# EAGLE design JogWheel (EAGLE 7.5.0)
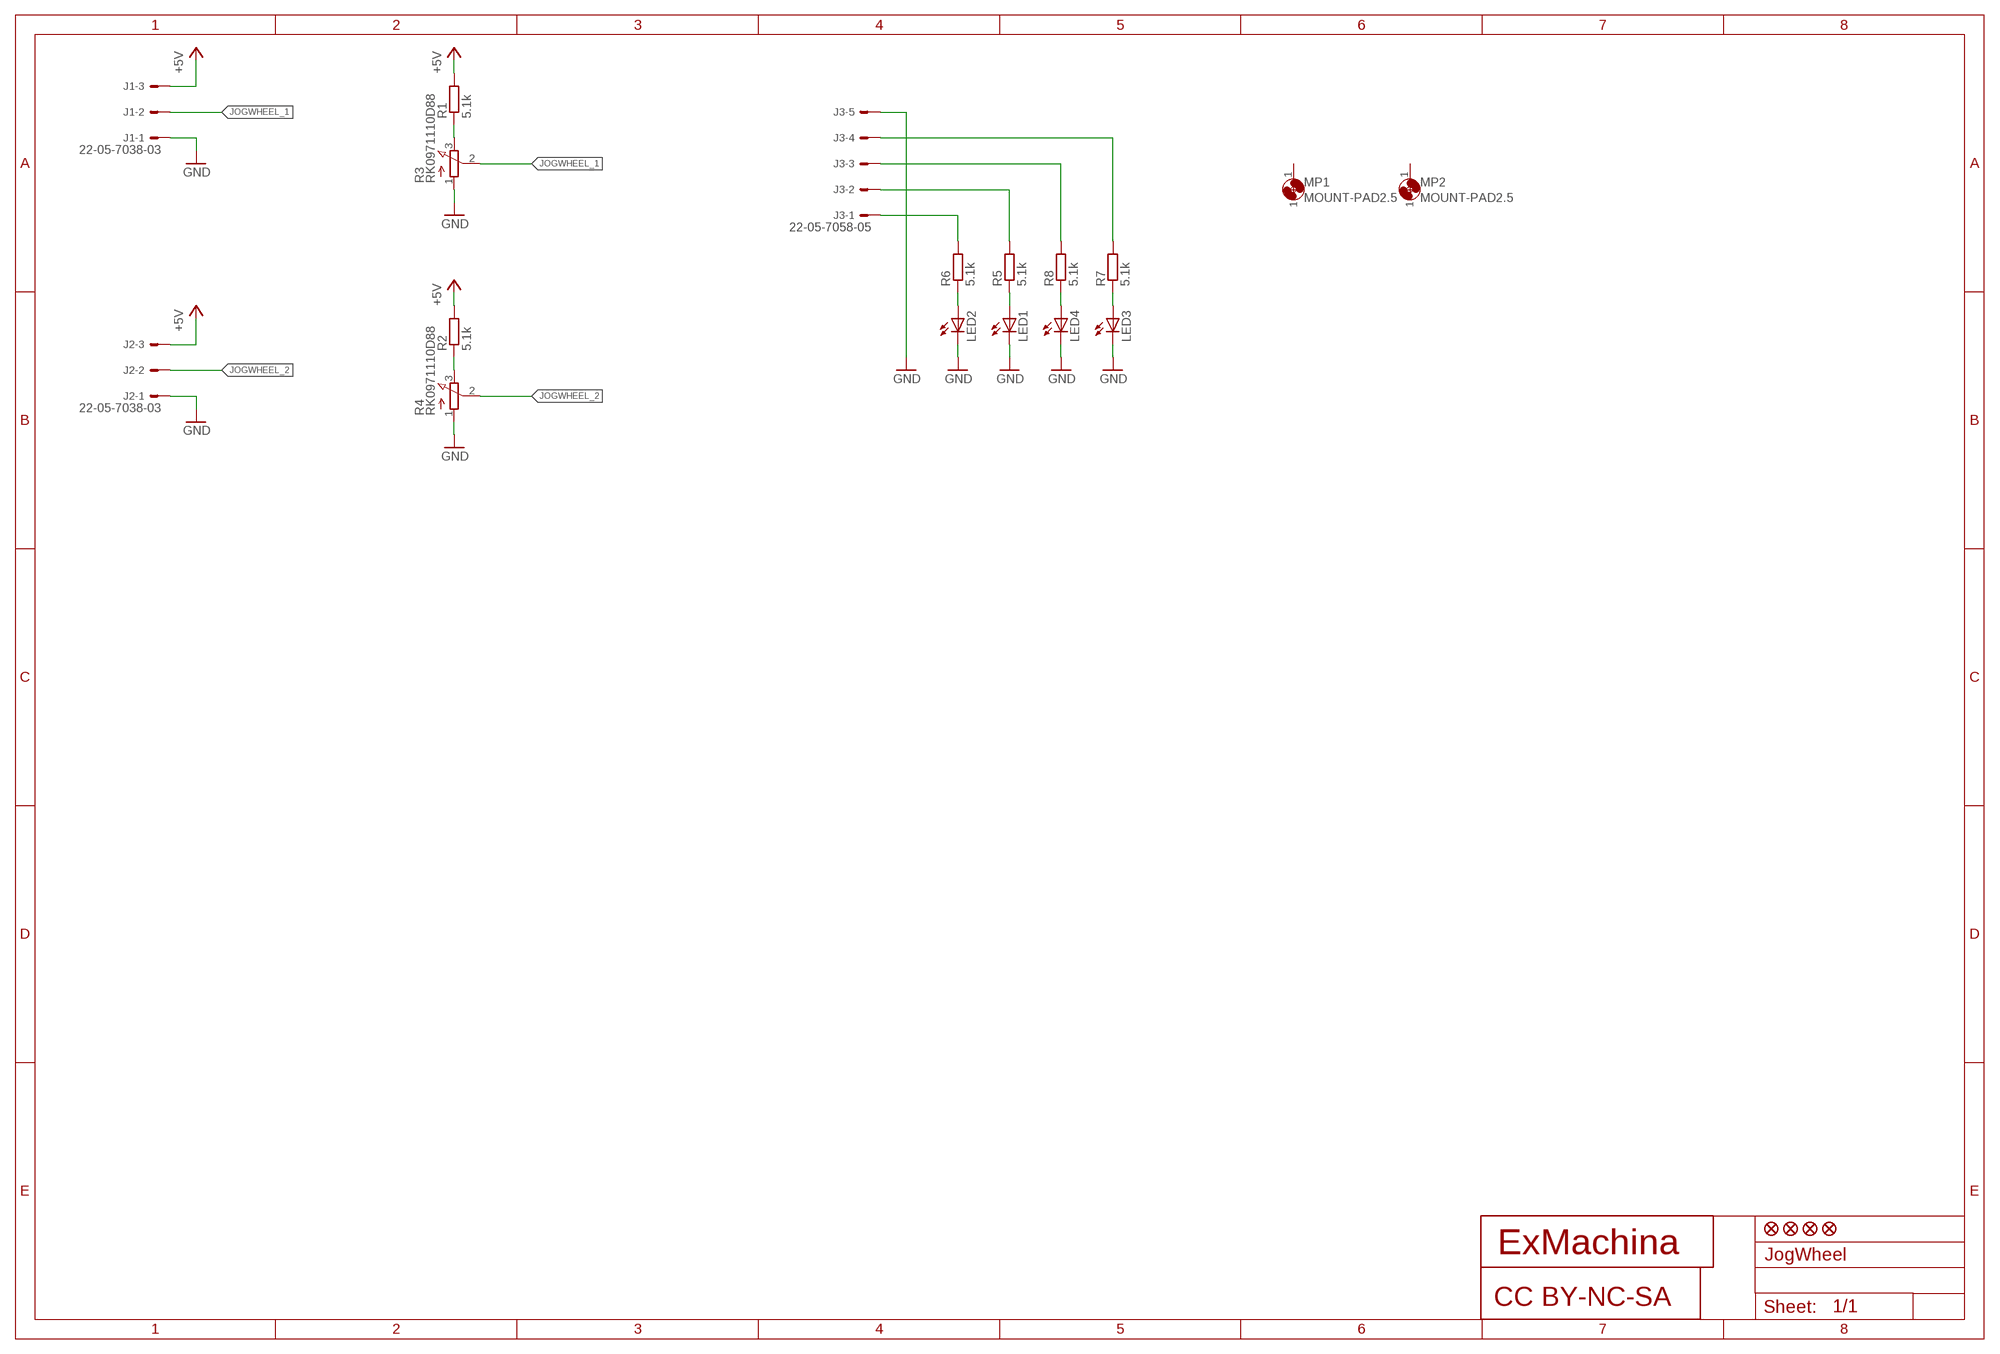
[diagram p0: schematic, sheet 1]

## Parts
J1  22-05-7038-03  [7395-03]
J2  22-05-7038-03  [7395-03]
J3  22-05-7058-05  [7395-05]
JP1  FIDUCIAL1X2  [FIDUCIAL-1X2]
JP2  FIDUCIAL1X2  [FIDUCIAL-1X2]
JP3  FIDUCIAL1X2  [FIDUCIAL-1X2]
JP4  FIDUCIAL1X2  [FIDUCIAL-1X2]
LED1  LEDCHIP-LED0603  [CHIP-LED0603]
LED2  LEDCHIP-LED0603  [CHIP-LED0603]
LED3  LEDCHIP-LED0603  [CHIP-LED0603]
LED4  LEDCHIP-LED0603  [CHIP-LED0603]
MP1  MOUNT-PAD2.5  [P2.5]
MP2  MOUNT-PAD2.5  [P2.5]
R1  5.1k  R-EU_R0603  [R0603]
R2  5.1k  R-EU_R0603  [R0603]
R3  RK0971110D88  [RK097]
R4  RK0971110D88  [RK097]
R5  5.1k  R-EU_R0603  [R0603]
R6  5.1k  R-EU_R0603  [R0603]
R7  5.1k  R-EU_R0603  [R0603]
R8  5.1k  R-EU_R0603  [R0603]
U$1  EXMACHINA-LOGO-NAME  [EXM-LOGO-BASELINE]
U$2  CC-BY-NC-SA  [CC-BY-NC-SA]

## Nets
+5V: J1.3 J2.3 R1.2 R2.2
GND: J1.1 J2.1 J3.5 LED1.C LED2.C LED3.C LED4.C R3.1(A) R4.1(A)
JOGWHEEL_1: J1.2 R3.2(S)
JOGWHEEL_2: J2.2 R4.2(S)
N$1: R1.1 R3.3(E)
N$2: R2.1 R4.3(E)
N$3: LED1.A R5.1
N$4: LED2.A R6.1
N$5: LED3.A R7.1
N$6: LED4.A R8.1
N$7: J3.4 R7.2
N$8: J3.1 R6.2
N$9: J3.2 R5.2
N$10: J3.3 R8.2
Unconnected: MP1.1 MP2.1

## Library data of the parts
J1 J2 = con-molex:22-?-03: CONNECTOR wire to board 2.54 mm (.1 inch) pitch header; OC_FARNELL: 9731610; OC_NEWARK: unknown
J3 = con-molex:22-?-05: CONNECTOR wire to board 2.54 mm (.1 inch) pitch header; OC_FARNELL: unknown; OC_NEWARK: unknown
JP1-JP4 = SparkFun:FIDUCIAL: Fiducial Alignment Points Various fiducial points for machine vision alignment.
LED1-LED4 = led:LED: LED OSRAM: - CHIPLED LG R971, LG N971, LY N971, LG Q971, LY Q971, LO R971, LY R971 LH N974, LH R974 LS Q976, LO Q976, LY Q976 LO Q996 - Hyper CHIPLED LW Q18S LB Q993, LB Q99A, LB R99A - SideLED LS A670, LO A670, LY A670, LG A670, LP A670 LB A673, LV A673, LT A673, LW A673 LH A674 LY A675 LS A676, LA A676, LO A676, LY A676, LW A676 LS A679, LY A679, LG A679 - Hyper Micro SIDELED® LS Y876, LA Y876, LO Y876, LY Y876 LT Y87S - SmartLED LW L88C, LW L88S LB L89C, LB L89S, LG L890 LS L89K, LO L89K, LY L89K LS L896, LA L896, LO L896, LY L896 - TOPLED LS T670, LO T670, LY T670, LG T670, LP T670 LSG T670, LSP T670, LSY T670, LOP T670, LYG T670 LG T671, LOG T671, LSG T671 LB T673, LV T673, LT T673, LW T673 LH T674 LS T676, LA T676, LO T676, LY T676, LB T676, LH T676, LSB T676, LW T676 LB T67C, LV T67C, LT T67C, LS T67K, LO T67K, LY T67K, LW E67C LS E67B, LA E67B, LO E67B, LY E67B, LB E67C, LV E67C, LT E67C LW T67C LS T679, LY T679, LG T679 LS T770, LO T770, LY T770, LG T770, LP T770 LB T773, LV T773, LT T773, LW T773 LH T774 LS E675, LA E675, LY E675, LS T675 LS T776, LA T776, LO T776, LY T776, LB T776 LHGB T686 LT T68C, LB T68C - Hyper Mini TOPLED® LB M676 - Mini TOPLED Santana® LG M470 LS M47K, LO M47K, LY M47K Source: http://www.osram.convergy.de LUXEON: - LUMILED® LXK2-PW12-R00, LXK2-PW12-S00, LXK2-PW14-U00, LXK2-PW14-V00 LXK2-PM12-R00, LXK2-PM12-S00, LXK2-PM14-U00 LXK2-PE12-Q00, LXK2-PE12-R00, LXK2-PE12-S00, LXK2-PE14-T00, LXK2-PE14-U00 LXK2-PB12-K00, LXK2-PB12-L00, LXK2-PB12-M00, LXK2-PB14-N00, LXK2-PB14-P00, LXK2-PB14-Q00 LXK2-PR12-L00, LXK2-PR12-M00, LXK2-PR14-Q00, LXK2-PR14-R00 LXK2-PD12-Q00, LXK2-PD12-R00, LXK2-PD12-S00 LXK2-PH12-R00, LXK2-PH12-S00 LXK2-PL12-P00, LXK2-PL12-Q00, LXK2-PL12-R00 Source: www.luxeon.com KINGBRIGHT: KA-3528ASYC Source: www.kingbright.com
MP1 MP2 = holes:MOUNT-PAD: MOUNTING HOLE with drill center marker
R1 R2 R5-R8 = rcl:R-EU_: RESISTOR, European symbol
R3 R4 = pot:RK097?
U$1 = exmachina:EXMACHINA-LOGO
U$2 = cc-by-sa:CC-BY-NC-SA

## Board
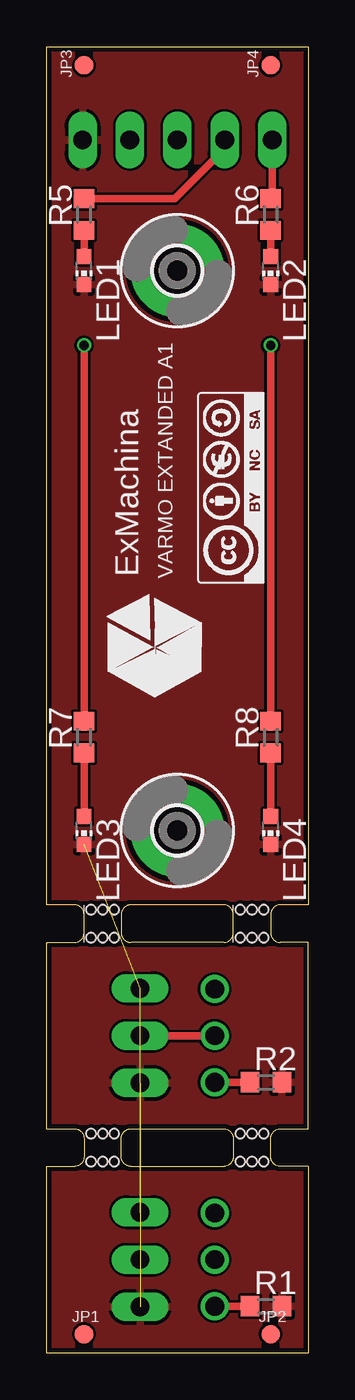
[diagram p1: board, top side]
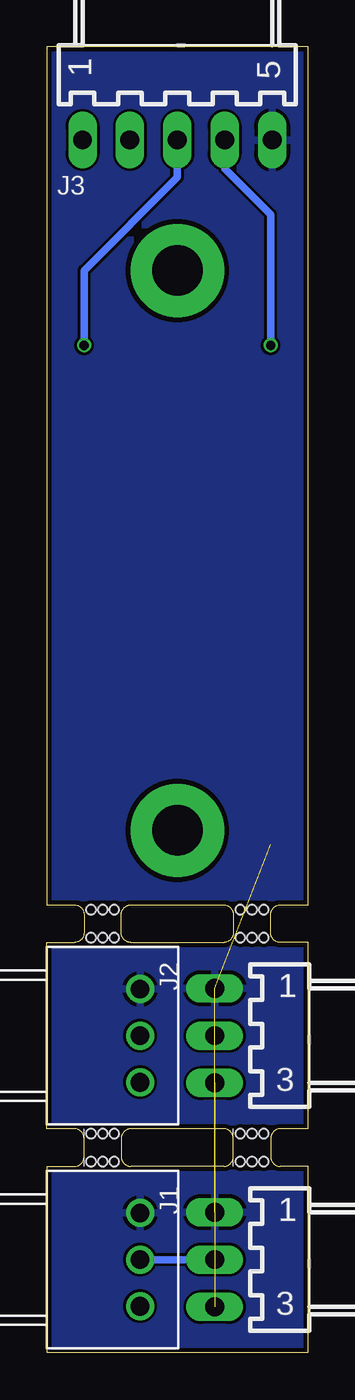
[diagram p2: board, bottom side, seen from below]

Size 14 x 70 mm. Coordinates in mm from the lower left corner, seen from the top.
Outline: 0,0 14,0 14,10 12.5,10 arc-90 12,10.5 12,11.5 arc-90 12.5,12 14,12 14,22 12.5,22 arc-90 12,22.5 12,23.5 arc-90 12.5,24 14,24 14,70 0,70 0,24 1.5,24 arc-90 2,23.5 2,22.5 arc-90 1.5,22 0,22 0,12 1.5,12 arc-90 2,11.5 2,10.5 arc-90 1.5,10 0,10 0,0
Outline: 4.5,24 arc90 4,23.5 4,22.5 arc90 4.5,22 9.5,22 arc90 10,22.5 10,23.5 arc90 9.5,24 4.5,24
Outline: 9.5,12 arc-90 10,11.5 10,10.5 arc-90 9.5,10 4.5,10 arc-90 4,10.5 4,11.5 arc-90 4.5,12 9.5,12
Copper layers (1*16): Top 0.018mm / dielectric 1.55mm / Bottom 0.018mm
Design rules "eC_2Layer_PClass6_BaseCopperO18_eCDefault": minimum track width 0.15mm, minimum drill 0.35mm, track to track 0.15mm, track to pad 0.15mm, pad to pad 0.15mm, via to via 0.15mm, smd to smd 0mil, copper to edge 0.25mm, drill to drill 0.35mm, minimum pad ring 0.175mm, minimum via ring 0.125mm, stop-mask expansion 0mil, vias tented up to drill 0.45mm, thermal gap 0.2mm
Holes 0.5 mm at 3,22.25 3,23.75 2.38,23.75 3.62,23.75 2.38,22.25 3.62,22.25 11,22.25 11,23.75 10.38,23.75 11.62,23.75 10.38,22.25 11.62,22.25 11,10.25 11,11.75 11.62,11.75 10.38,11.75 11.62,10.25 10.38,10.25 3,10.25 3,11.75 3.62,11.75 2.38,11.75 3.62,10.25 2.38,10.25

### Footprints (pad centres in the part's own frame; a part is rotated, then mirrored left to right if it is on the bottom)
7395-03 = drill 1.016 long: 1 2.54,0; 2 0,0; 3 -2.54,0
7395-05 = drill 1.016 long: 1 5.08,0; 2 2.54,0; 3 0,0; 4 -2.54,0; 5 -5.08,0
FIDUCIAL-1X2 = smd 1 x 1: 1 0,0
CHIP-LED0603 = smd 0.8 x 0.8: A 0,-0.75; C 0,0.75
P2.5 = drill 2.7 pad 5: 1 0,0
R0603 = smd 1 x 1.1: 1 -0.85,0; 2 0.85,0
RK097 = drill 1: 1 -5,-2.5; 2 -5,0; 3 -5,2.5

### Placement (x,y rotation side)
J1  5,5 90 bottom
J2  5,17 90 bottom
J3  7,65 180 bottom
JP1  2,1 0 top
JP2  12,1 0 top
JP3  2,69 90 top
JP4  12,69 90 top
LED1  2,58 180 top
LED2  12,58 180 top
LED3  2,28 180 top
LED4  12,28 180 top
MP1  7,28 270 top
MP2  7,58 270 top
R1  11.75,2.5 0 top
R2  11.75,14.5 0 top
R3  14,5 180 bottom
R4  14,17 180 bottom
R5  2,61 90 top
R6  12,61 90 top
R7  2,33 90 top
R8  12,33 90 top
U$1  5.81,37.81 90 top
U$2  9.89,46.35 90 top

### Tracks (layer width: path | path; a pad name or v marks a point on that pad's centre or on a via)
+5V  (1 unrouted)
  pour Top: -15,23 32,23 32,-4 -15,-4
GND  (2 unrouted)
  pour Bottom: -12,81 27,81 27,-5 -12,-5
  pour Top: -5,80 20,80 19,24 -6,24
JOGWHEEL_1
  Bottom 0.406: J1.2 R3.2
JOGWHEEL_2
  Top 0.406: J2.2 R4.2
N$1
  Top 0.406: R3.3 R1.1
N$2
  Top 0.406: R4.3 R2.1
N$3
  Top 0.406: LED1.A R5.1
N$4
  Top 0.406: R6.1 LED2.A
N$5
  Top 0.406: LED3.A R7.1
N$6
  Top 0.406: LED4.A R8.1
N$7  (via drill 0.5)
  Top 0.406: R7.2 v2,54
  Bottom 0.406: v2,54 2,61 4.46,63.46 J3.4
N$8
  Top 0.406: J3.1 12.08,61.93 R6.2
N$9
  Top 0.406: R5.2 6.85,61.85 9.54,64.54 J3.2
N$10  (via drill 0.5)
  Top 0.406: R8.2 v12,54
  Bottom 0.406: v12,54 12,58 7,63 J3.3

### Text on the board
tPlace: VARMO EXTANDED A1